# EAGLE design powermodule (EAGLE 7.7.0)
COMPANY: ADAFRUIT INDUSTRIES; DRAWN: KTOWN; REV: A
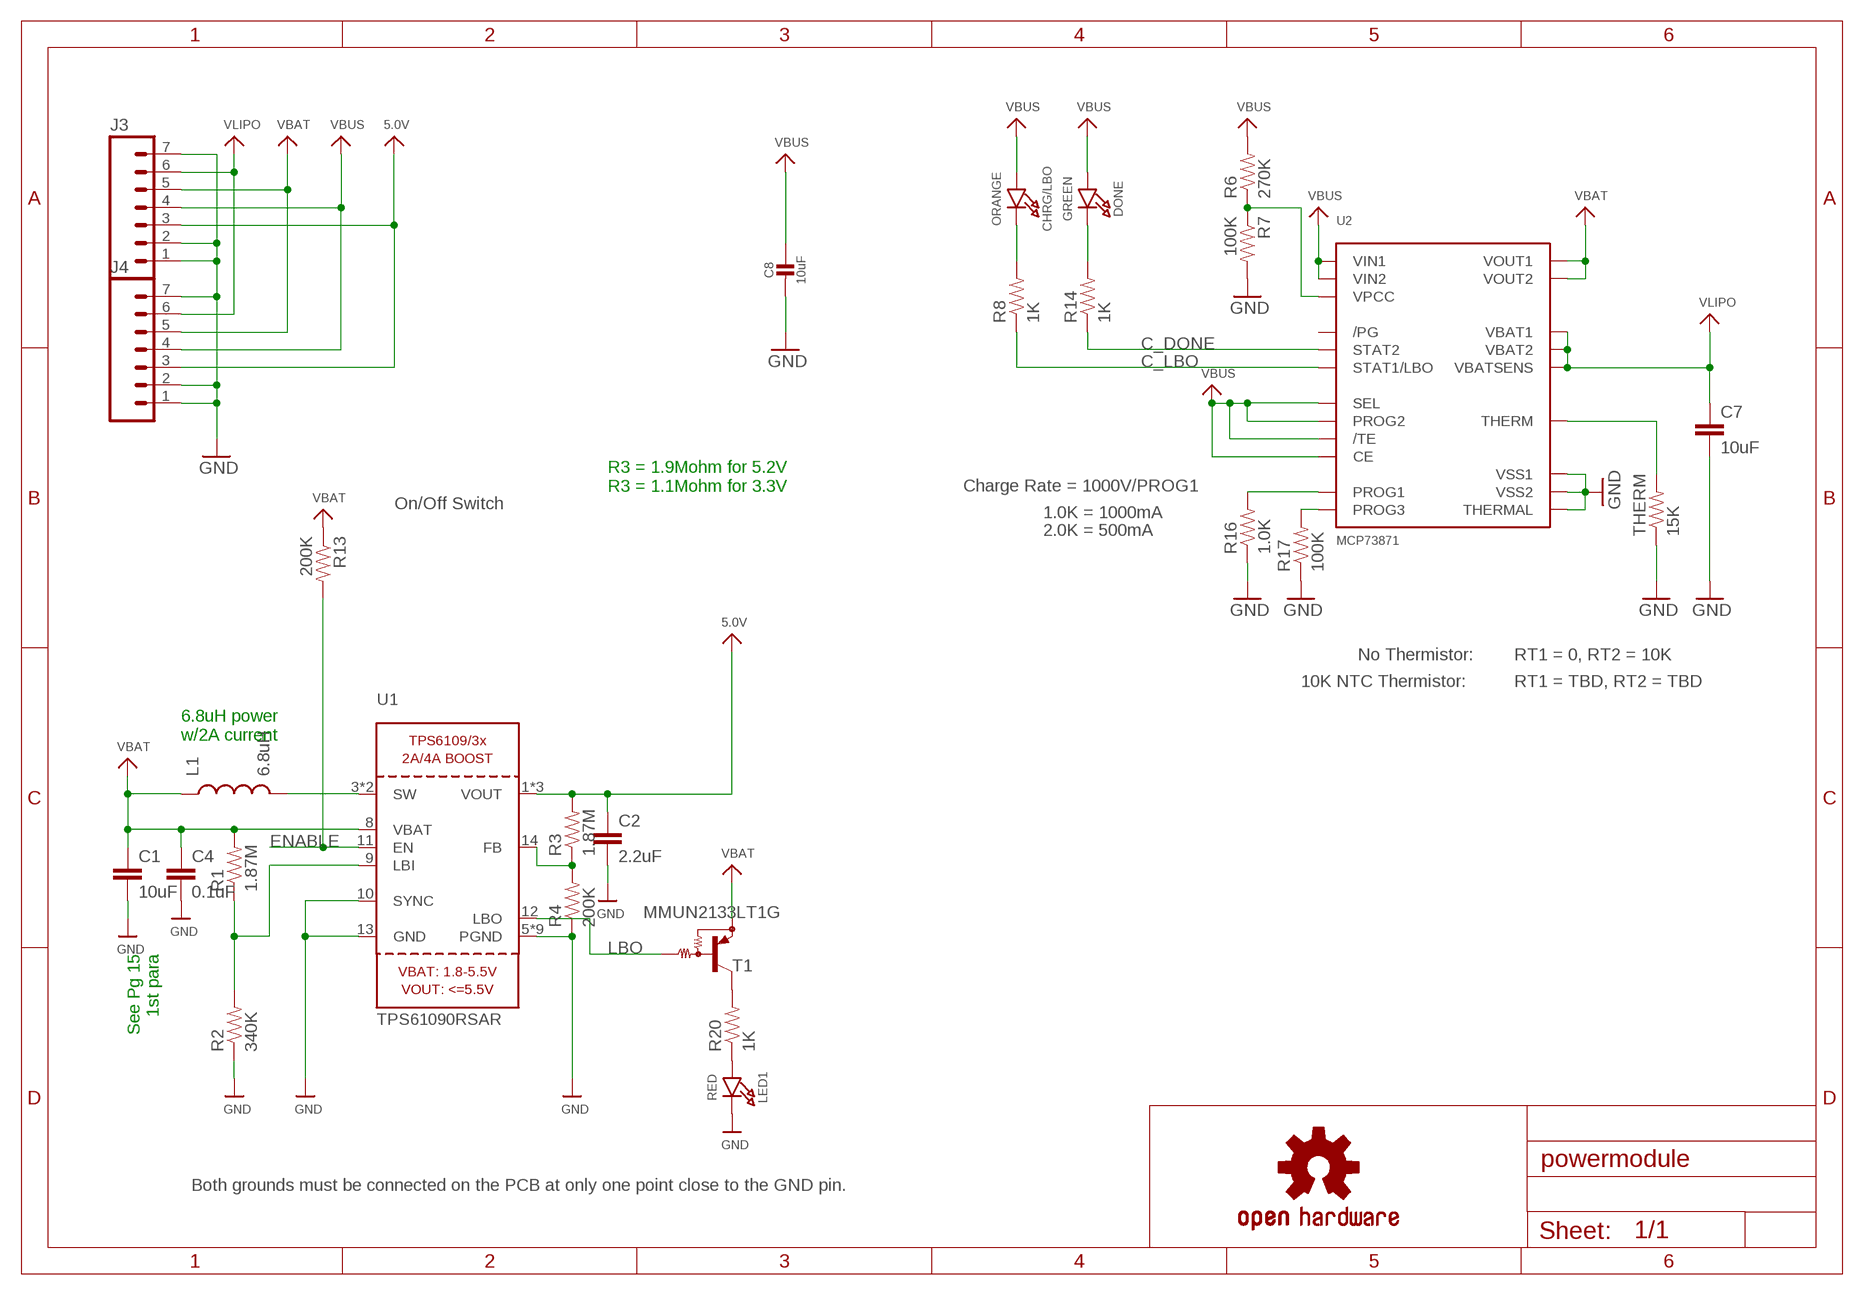
[diagram p0: schematic, sheet 1]

## Parts
C1  10uF  CAP0603-CAP  [0603-CAP]
C2  2.2uF  CAP0603-CAP  [0603-CAP]
C4  0.1uF  CAP0603-CAP  [0603-CAP]
C7  10uF  CAP0603-CAP  [0603-CAP]
C8  10uF  CAP_CERAMIC0805-NOOUTLINE  [0805-NO]
CHRG/LBO  ORANGE  LED0805_NOOUTLINE  [CHIPLED_0805_NOOUTLINE]
DONE  GREEN  LED0805_NOOUTLINE  [CHIPLED_0805_NOOUTLINE]
J3  M07  [1X07]
J4  M07  [1X07]
L1  6.8uH  INDUCTORSRU5028  [SRU5028]
LED1  RED  LED0805_NOOUTLINE  [CHIPLED_0805_NOOUTLINE]
LOGO1  OSHW-LOGOS  [OSHW-LOGO-S]
R1  1.87M  RESISTOR0603-RES  [0603-RES]
R2  340K  RESISTOR0603-RES  [0603-RES]
R3  1.87M  RESISTOR0603-RES  [0603-RES]
R4  200K  RESISTOR0603-RES  [0603-RES]
R6  270K  RESISTOR0603-RES  [0603-RES]
R7  100K  RESISTOR0603-RES  [0603-RES]
R8  1K  RESISTOR0603-RES  [0603-RES]
R13  200K  RESISTOR0603-RES  [0603-RES]
R14  1K  RESISTOR0603-RES  [0603-RES]
R16  1.0K  RESISTOR0603-RES  [0603-RES]
R17  100K  RESISTOR0603-RES  [0603-RES]
R20  1K  RESISTOR0603-RES  [0603-RES]
T1  MMUN2133LT1G  MUN2114T1-PNP_DRIVER-SC59-BEC  [SC59-BEC]
THERM  15K  RESISTOR0603-RES  [0603-RES]
U1  TPS61090RSAR  VREG_TPS6103X  [PVQFN-16]
U2  MCP73871  [QFN20_4MM]

## Nets
5.0V: C2.1 J3.3 J4.3 R3.2 U1.1(VOUT) U1.15(VOUT) U1.16(VOUT)
C_DONE: R14.1 U2.P$7(STAT2)
C_LBO: R8.1 U2.P$8(STAT1/LBO)
ENABLE: R13.2 U1.11(EN)
GND: C1.2 C2.2 C4.2 C7.2 C8.2 J3.1 J3.2 J3.7 J4.1 J4.2 J4.7 LED1.C R2.1 R4.1 R7.2 R16.1 R17.1 THERM.1 U1.5(PGND) U1.6(PGND) U1.7(PGND) U1.10(SYNC) U1.13(GND) U1.P$18(PGND) U1.P$19(PGND) U1.P$20(PGND) U1.P$21(PGND) U1.P$22(PGND) U1.THERMAL(PGND) U2.P$10(VSS1) U2.P$11(VSS2) U2.P$21(THERMAL)
LBO: T1.B U1.12(LBO)
N$1: L1.2 U1.3(SW) U1.4(SW)
N$2: LED1.A R20.1
N$3: R1.1 R2.2 U1.9(LBI)
N$5: R3.1 R4.2 U1.14(FB)
N$6: R20.2 T1.C
N$7: R6.1 R7.1 U2.P$2(VPCC)
N$8: DONE.C R14.2
N$10: THERM.2 U2.P$5(THERM)
N$12: CHRG/LBO.C R8.2
N$13: R17.2 U2.P$12(PROG3)
N$16: R16.2 U2.P$13(PROG1)
VBAT: C1.1 C4.1 J3.5 J4.5 L1.1 R1.2 R13.1 T1.E U1.8(VBAT) U2.P$1(VOUT1) U2.P$20(VOUT2)
VBUS: C8.1 CHRG/LBO.A DONE.A J3.4 J4.4 R6.2 U2.P$3(SEL) U2.P$4(PROG2) U2.P$9(/TE) U2.P$17(CE) U2.P$18(VIN1) U2.P$19(VIN2)
VLIPO: C7.1 J3.6 J4.6 U2.P$14(VBAT1) U2.P$15(VBAT2) U2.P$16(VBATSENS)
Unconnected: U2.P$6(/PG)

## Notes on the sheet
- R3 = 1.9Mohm for 5.2V
  R3 = 1.1Mohm for 3.3V
- Charge Rate = 1000V/PROG1
- On/Off Switch
- 1.0K = 1000mA
- 2.0K = 500mA
- No Thermistor: | RT1 = 0, RT2 = 10K
- 10K NTC Thermistor: | RT1 = TBD, RT2 = TBD
- 6.8uH power
  w/2A current
- See Pg 15
  1st para
- Both grounds must be connected on the PCB at only one point close to the GND pin.

## Library data of the parts
C1 C2 C4 C7 = SparkFun-Capacitors:CAP: Capacitor Standard 0603 ceramic capacitor, and 0.1" leaded capacitor.
C8 = microbuilder:CAP_CERAMIC: Ceramic Capacitors For new designs, use the packages preceded by an '_' character since they are more reliable: The following footprints should be used on most boards: _0402 - Standard footprint for regular board layouts _0603 - Standard footprint for regular board layouts _0805 - Standard footprint for regular board layouts _1206 - Standard footprint for regular board layouts For extremely tight-pitch boards where space is at a premium, the following 'micro-pitch' footprints can be used (smaller pads, no silkscreen outline, etc.): _0402MP - Micro-pitch footprint for very dense/compact boards _0603MP - Micro-pitch footprint for very dense/compact boards _0805MP - Micro-pitch footprint for very dense/compact boards _1206MP - Micro-pitch footprint for very dense/compact boards
CHRG/LBO DONE LED1 = microbuilder:LED: LED 0603 - 0603 Surface Mount Package 2mA: Green LED - Low Power (3.9mcd, 2ma, 1.7Vf) - Digikey: 475-2709-2-ND Orange LED - Low Power (9.8mcd, 2ma, 1.8Vf) - Digikey: 475-1194-2-ND Red LED - Low Power (5mcd, 2ma, 1.8Vf) - Digikey: 475-1195-2-ND Yellow LED - Low Power (7mcd, 2ma, 1.8Vf) - Digikey: 475-1196-2-ND 5mA: Blue LED - Low Power (17mcd, 5ma, 2.9Vf) - Digikey: LNJ937W8CRACT-ND 0805 - 0805 Surface Mount Package 2mA: Red LED (8.8mcd, 2mA, 1.8Vf, Clear) - Low Power [Digikey: 475-2510-1-ND] Green LED (5mcd, 2mA, 1.8Vf, Clear) - Low Power [Digikey: 475-2730-1-ND] Yellow LED (11.3mcd, 2mA, 1.8Vf, Clear) - Low Power [Digikey: 475-2555-1-ND] 20mA: Red LED (104mcd, 20mA, Diffused) - LS R976 [Digikey: 475-1278-6-ND] Red LED (12mcd, 20mA, 2.0Vf, Clear) - APT2012EC [Digikey: 754-1128-1-ND] Green LED (15mcd, 20mA, 2.2Vf, Clear) - APT2012GC [Digikey: 754-1131-1-ND] Orange LED (160mcd, 20mA, 2.1Vf, Clear) - APT2012SECK [Digikey: 754-1130-1-ND] 1206 - 1206 Surface Mount Package Green LED (26mcd, 20mA, Diffused) - LG N971 [Digikey: 475-1407-6-ND] Red LED (15mcd, 20mA, Diffused) - LH N974 [Digikey: 475-1416-6-ND] Cree - Cree High-Power Surface Mount LEDs XPEBWT-L1-0000-00D50 - White 111lm 350mA 2.9Vf 6200K 110° XTEAWT-00-0000-00000LEE3 - White 114lm 350mA 2.85Vf 5000K 115° Everlight - Everlight 45-21 Series Surface Mount LEDs 45-21/QK2C-B2832AC2CB2/2T - Warm White 2000mcd 20mA 3.25Vf 3050K 120° 45-21/LK2C-B38452C4CB2/2T - Nuetral White 2000mcd 20mA 3.25Vf 4150K 120° 45-21/LK2C-B50634C6CB2/2T - Cold White 2200mcd 20mA 3.25Vf 5650K 120° PLCC2 Reverse Mount LS T77K-J1L2-1-0-2-R18-Z - Red 11.25mcd 2mA 1.8Vf 630nm 120° LO T77K-L1M2-24-Z - Orange 19.6mcd 2mA 1.8Vf 606nm 120° LY T77K-K2M1-26-Z - Yellow 15.7mcd 2mA 1.8Vf 587nm 120°
J3 J4 = SparkFun-Connectors:M07: Header 7 Standard 7-pin 0.1" header. Use with straight break away headers (SKU : PRT-00116), right angle break away headers (PRT-00553), swiss pins (PRT-00743), machine pins (PRT-00117), and female headers (PRT-00115). NOTES ON THE VARIANTS LOCK and LOCK_LONGPADS... This footprint was designed to help hold the alignment of a through-hole component (i.e. 7-pin header) while soldering it into place. You may notice that each hole has been shifted either up or down by 0.005 of an inch from it's more standard position (which is usually a perfectly straight line). This slight alteration caused the pins (the squares in the middle) to touch the edges of the holes. Because they are alternating, it causes a "brace" to hold the header in place. 0.005 has proven to be the perfect amount of "off-center" position when using our standard breakaway headers. Although looks a little odd when you look at the bare footprint, once you have a header in there, the alteration is very hard to notice. Also, if you push a header all the way into place, it is covered up entirely on the bottom side. This idea of altering the position of holes to aid alignment will be further integrated into the Sparkfun Library for other footprints. It can help hold any component with 3 or more connection pins.
L1 = SparkFun-Passives:INDUCTOR: Inductors Basic Inductor/Choke - 0603 and 1206. Footprints are not proven and vary greatly between part numbers. INDUCTOR POWER 3.3UH 4.0A SMD 0.197" L x 0.197" W x 0.177" H (5.00mm x 5.00mm x 4.50mm)
LOGO1 = SparkFun-Aesthetics:OSHW-LOGO: Open Source Hardware Logo This logo indicates the piece of hardware it is found on incorporates a OSHW license and/or adheres to the definition of open source hardware found here: http://freedomdefined.org/OSHW
R1-R4 R6-R8 R13 R14 R16 R17 R20 THERM = SparkFun-Resistors:RESISTOR: Resistor Basic schematic elements and footprints for 0603, 1206, and PTH resistors.
T1 = transistor:*-PNP_DRIVER-: PNP Bias Resistor Transistor
U1 = microbuilder:VREG_TPS6103X: TPS6103x 4A Boost - 1.8-5.5V Input, Adjustable Output to 5.5V
U2 = microbuilder:MCP73871: MCP73871 Lithium Polymer Battery Charger Digikey: MCP73871-2CCI/ML-ND

## Board
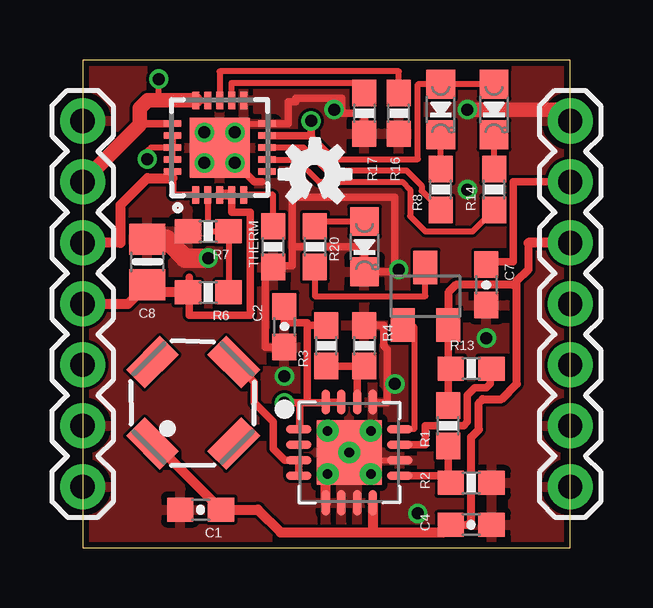
[diagram p1: board, top side]
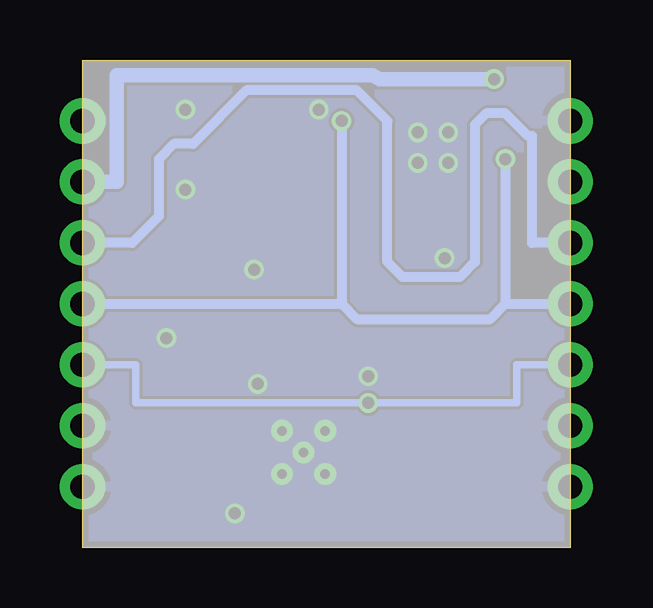
[diagram p2: board, bottom side, seen from below]

Size 20.32 x 20.32 mm. Coordinates in mm from the lower left corner, seen from the top.
Outline: 0,0 20.32,0 20.32,20.32 0,20.32 0,0
Copper layers (1*16): Top 0.035mm / dielectric 1.5mm / Bottom 0.035mm
Design rules "dirtypcbs": minimum track width 5mil, minimum drill 12mil, track to track 5mil, track to pad 5mil, pad to pad 5mil, via to via 5mil, smd to smd 0mil, copper to edge 10mil, drill to drill 10mil, minimum pad ring 10mil, minimum via ring 6mil, stop-mask expansion 2mil, vias tented up to drill 25mil, thermal gap 10mil

### Footprints (pad centres in the part's own frame; a part is rotated, then mirrored left to right if it is on the bottom)
0603-CAP = smd 1.1 x 1: 1 -0.85,0; 2 0.85,0
0805-NO = smd 1.3 x 1.5: 1 -0.95,0; 2 0.95,0
CHIPLED_0805_NOOUTLINE = smd 1.2 x 1.2: A 0,-1.05; C 0,1.05
1X07 = drill 1.016 pad 1.88: 1 0,0; 2 2.54,0; 3 5.08,0; 4 7.62,0; 5 10.16,0; 6 12.7,0; 7 15.24,0
SRU5028 = smd 1.1 x 2: 1 2.4,0; 2 -2.4,0 | smd 2 x 1.1: P$1 0,2.4; P$2 0,-2.4
0603-RES = smd 1.1 x 1: 1 -0.85,0; 2 0.85,0
SC59-BEC = smd 1 x 1.4: B -0.95,-1.2; C 0,1.2; E 0.95,-1.2
PVQFN-16 = smd 1.05 x 0.35: 1 -2.1,0.975; 2 -2.1,0.325; 3 -2.1,-0.325; 4 -2.1,-0.975; 9 2.1,-0.975; 10 2.1,-0.325; 11 2.1,0.325; 12 2.1,0.975 | smd 0.35 x 1.05: 5 -0.975,-2.1; 6 -0.325,-2.1; 7 0.325,-2.1; 8 0.975,-2.1; 13 0.975,2.1; 14 0.325,2.1; 15 -0.325,2.1; 16 -0.975,2.1 | drill 0.4: P$18 0,0; P$19 -0.9,0.9; P$20 0.9,0.9; P$21 0.9,-0.9; P$22 -0.9,-0.9 | smd 2.7 x 2.7: THERMAL 0,0
QFN20_4MM = smd 0.73 x 0.28: P$1 -1.965,1; P$2 -1.965,0.5; P$3 -1.965,0; P$4 -1.965,-0.5; P$5 -1.965,-1; P$11 1.965,-1; P$12 1.965,-0.5; P$13 1.965,0; P$14 1.965,0.5; P$15 1.965,1 | smd 0.28 x 0.73: P$6 -1,-1.965; P$7 -0.5,-1.965; P$8 0,-1.965; P$9 0.5,-1.965; P$10 1,-1.965; P$16 1,1.965; P$17 0.5,1.965; P$18 0,1.965; P$19 -0.5,1.965; P$20 -1,1.965 | smd 2.5 x 2.5: P$21 0,0

### Placement (x,y rotation side)
C1  4.92,1.59 180 top
C2  8.41,9.21 270 top
C4  16.19,0.95 0 top
C7  16.83,10.95 270 top
C8  2.7,11.91 90 top
CHRG/LBO  14.92,18.26 180 top
DONE  17.14,18.26 180 top
J3  0,2.54 90 top
J4  20.32,2.54 90 top
L1  4.6,6.03 225 top
LED1  11.75,12.54 180 top
LOGO1  9.68,15.56 0 top
R1  15.24,5.08 90 top
R2  16.19,2.7 180 top
R3  10.16,8.41 90 top
R4  11.75,8.41 270 top
R6  5.24,10.64 180 top
R7  5.24,13.18 180 top
R8  14.92,14.92 90 top
R13  16.19,7.46 0 top
R14  17.14,14.92 90 top
R16  13.18,18.1 90 top
R17  11.75,18.1 90 top
R20  9.68,12.54 270 top
T1  14.29,10.48 0 top
THERM  7.94,12.54 90 top
U1  11.11,3.97 0 top
U2  5.71,16.67 90 top

### Tracks (layer width: path | path; a pad name or v marks a point on that pad's centre or on a via)
5.0V  (via drill 0.5 pad 0.41)
  Top 0.305: U1.15 U1.16 10.14,6.03 9.37,6.03 | U1.1 9.05,4.94 9.05,6.03 | 9.05,6.03 9.37,6.03 | 9.05,6.03 v8.41,6.03 | R3.2 9.37,9.26 | 9.37,9.26 9.37,9.37 8.41,9.37 C2.1 | 9.37,9.26 9.37,6.03
  Bottom 0.305: J4.3 18.1,7.62 18.1,6.03 v8.41,6.03 2.22,6.03 2.22,7.62 J3.3
C_DONE
  Top 0.254: U2.P$7 8.91,16.17 9.84,15.24 13.34,15.24 13.65,14.92 13.65,13.81 14.29,13.18 16.25,13.18 R14.1
C_LBO
  Top 0.254: R8.1 14.13,14.87 14.13,15.08 13.49,15.72 10.16,15.72 9.21,16.67 U2.P$8
ENABLE
  Top 0.305: U1.11 14.29,4.29 14.29,5.08 15.88,5.08 16.03,5.24 16.03,6.35 16.35,6.67 16.83,6.67 16.99,6.83 16.99,7.41 R13.2 17.14,7.46
GND  (via drill 0.5 pad 0.41)
  Top 0.254: v6.35,17.3 6.03,17.67 U2.P$10 | U1.P$21 12.01,3.64 U1.10
  Top 0.305: U2.P$21 v5.08,16.03 v6.35,16.03 7.14,15.24 7.46,15.24 | 11.75,17.67 R17.1 11.75,18.1 10.79,18.1 10.79,18.73 8.89,18.73 8.89,18.57 8.57,18.57 8.57,17.67 U2.P$10 | R4.1 12.54,9.26 12.54,8.41 12.7,8.26 12.7,6.03 12.09,6.03 U1.13 | LED1.C 13.02,11.49 13.02,14.61 8.73,14.61 8.73,12.54 | 7.94,11.75 7.62,11.75 7.62,11.59 | 7.94,11.75 THERM.1 7.94,11.59 7.62,11.59 | LED1.C 12.86,11.49 v13.18,11.59 | LED1.C 11.75,12.54 8.73,12.54 | 8.73,12.54 8.73,11.75 7.94,11.75 | 7.62,11.59 7.62,8.36 C2.2
  Top 0.406: U1.5 10.14,3.07 U1.P$21 U1.P$22
  Top 0.61: J4.7 19.84,18.26 v16.03,18.26
  Top 0.813: C8.2 3.5,12.86 4.29,12.06 v5.24,12.06
  other vias: 5.08,17.3 13.97,1.43 8.41,7.14 13.02,6.83 16.83,8.73 10.48,18.26 16.03,14.92
  pour Top: 20.32,20.32 0,20.32 0,0 20.32,0
  pour Bottom: 20.32,20.32 0,20.32 0,0 20.32,0
LBO
  Top 0.254: T1.B 13.34,9.21 13.81,9.21 13.81,4.94 U1.12
N$1
  Top 0.305: U1.4 U1.3 8.42,3.64 7.94,4.13 7.94,5.24 7.14,6.03 7.14,6.89 L1.2
N$2
  Top 0.254: R20.1 9.68,13.59 LED1.A
N$3
  Top 0.305: U1.9 15.34,2.99 R2.2 15.24,2.7 R1.1
N$5
  Top 0.305: U1.14 11.44,7.56 R4.2 R3.1
N$6
  Top 0.254: R20.2 9.68,10.48 14.29,10.48 T1.C
N$7
  Top 0.254: R6.1 R7.1 5.21,13.18 U2.P$2
N$8
  Top 0.254: R14.2 DONE.C
N$10
  Top 0.254: THERM.2 7.94,14.7 U2.P$5
N$12
  Top 0.254: R8.2 CHRG/LBO.C
N$13
  Top 0.254: U2.P$12 6.21,19.37 11.75,19.37 R17.2
N$16
  Top 0.254: R16.2 13.18,19.84 5.71,19.84 U2.P$13
VBAT
  Top 0.254: U2.P$1 3.75,14.7
  Top 0.305: 3.75,14.7 U2.P$20 3.75,15.4 | R1.2 15.24,7.46 R13.1 15.24,7.46 T1.E
  Top 0.343: 18.57,12.7 18.57,11.59 18.1,11.11 | 18.1,11.11 17.94,10.95 15.56,10.95 15.24,10.64 15.24,9.44 | C4.1 16.03,0.95 16.19,1.11 16.19,4.6 16.51,4.92 16.51,6.03 16.67,6.19 17.46,6.19 18.1,6.83 18.1,11.11
  Top 0.406: J3.5 1.59,12.7 1.59,14.29 2.7,15.4 3.75,15.4 | L1.1 3.02,4.33 C1.1 7.3,1.59 8.26,0.64 12.06,0.64 | 12.06,0.64 15.03,0.64 C4.1 | U1.8 12.09,0.66 12.06,0.64 | J4.5 18.57,12.7 | 15.24,9.44 T1.E
  Bottom 0.406: J3.5 1.59,12.7 1.59,17.14 1.75,17.14 2.7,18.1 3.49,18.1 3.97,17.62 3.97,11.91 4.6,11.27 6.99,11.27 7.62,11.91 7.62,17.78 8.89,19.05 13.49,19.05 15.72,16.83 16.51,16.83 17.14,16.19 17.14,13.81 18.26,12.7 J4.5
VBUS  (via drill 0.5 pad 0.41)
  Top 0.254: DONE.A CHRG/LBO.A 13.97,19.31 13.97,16.19 10.48,16.19 9.53,17.14 8.91,17.14 8.89,17.17 | U2.P$19 U2.P$18 | U2.P$17 U2.P$18 | U2.P$18 2.86,16.67 2.7,16.51 v2.7,16.19
  Top 0.305: U2.P$9 8.89,17.17 9.53,17.17 v9.53,17.78 | U2.P$4 6.21,13.97 6.99,13.97 6.99,9.68 4.45,9.68 4.45,11.27 R6.2
  Top 0.406: R6.2 2.7,10.64 C8.1 1.9,10.16 J3.4 | U2.P$4 U2.P$3
  Bottom 0.406: v2.7,16.19 2.7,10.16 | 2.7,10.16 3.33,9.53 8.89,9.53 9.53,10.16 | J4.4 9.53,10.16 | v9.53,17.78 9.53,10.16 | 2.7,10.16 J3.4
VLIPO  (via drill 0.5 pad 0.41)
  Top 0.254: v3.17,19.53 3.17,18.63 U2.P$14
  Top 0.305: U2.P$16 2.49,17.67 2.38,17.78 2.38,18.3 | J4.6 17.94,15.24 17.94,11.9 16.83,11.9 C7.1
  Top 0.61: J3.6 2.38,17.62 2.38,18.3 2.71,18.63 3.17,18.63 U2.P$15
  Bottom 0.61: v3.17,19.53 7.94,19.53 8.26,19.68 18.89,19.68 18.89,15.24 J4.6

### Text on the board
Document: 5.0 output MUST have 100uf cap across it.